# Altium schematic sheet Sheet1.SchDoc
size A4
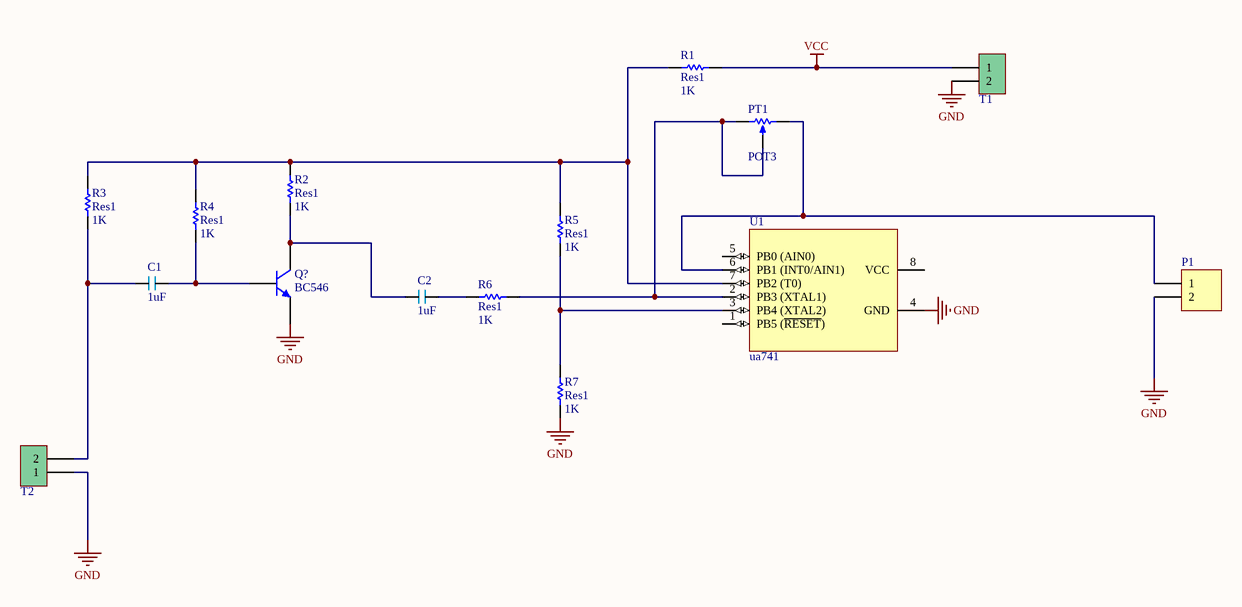
[diagram p0: Sheet1.SchDoc]

## Parts
C1  1uF  [RAD_ADA]
C2  1uF  [RAD_ADA]
P1  Header 2  [My_1X02]  (value not drawn)
PT1  POT3  [POT3]
Q?  BC546  [SOT54]
R1  Res1  value 1K  [AXIAL-0.3]
R2  Res1  value 1K  [AXIAL-0.3]
R3  Res1  value 1K  [AXIAL-0.3]
R4  Res1  value 1K  [AXIAL-0.3]
R5  Res1  value 1K  [AXIAL-0.3]
R6  Res1  value 1K  [AXIAL-0.3]
R7  Res1  value 1K  [AXIAL-0.3]
T1  Phoenix terminal  [phoenix terminal 2]  (value not drawn)
T2  Phoenix terminal  [phoenix terminal 2]  (value not drawn)
U1  ua741  [My_8P3]

## Nets
GND: P1.2 Q?.1(E) R7.1 T1.2 T2.1 U1.4(GND)
VCC: R1.1 T1.1
NetC1_1: C1.1 R3.1 T2.2
NetC1_2: C1.2 Q?.2(B) R4.1
NetC2_1: C2.1 Q?.3(C) R2.1
NetC2_2: C2.2 R6.2
NetP1_1: P1.1 PT1.2(BOT) U1.6(PB1_(INT0/AIN1))
NetPT1_1: PT1.1(TOP) PT1.3(TAP) R6.1 U1.2(PB3_(XTAL1))
NetR1_2: R1.2 R2.2 R3.2 R4.2 R5.2 U1.7(PB2_(T0))
NetR5_1: R5.1 R7.2 U1.3(PB4_(XTAL2))

Not connected (* = marked no-connect by the designer): U1 1(PB5_(~{RESET})) 5(PB0_(AIN0)) 8(VCC)

## Library data of the parts
C1 C2 = CAP
P1 = Header 2: Header, 2-Pin; LatestRevisionDate: 17-Jul-2002; LatestRevisionNote: Re-released for DXP Platform.; Publisher: Altium Limited
PT1 = POT3: Variable Potentiometer top adjust; Designer: Seyed Mohsen Ghasemian; WEB: www.picpars.com
Q? = BC546: NPN General-purpose Transistor; Published: 17-Sep-2003; LatestRevisionDate: 12-Dec-2006; LatestRevisionNote: Footprint pad sequence fixed.; DatasheetVersion: 15-Apr-1999; PackageVersion: Feb-1997; PackageReference: SOT54; Publisher: Altium Limited; PackageDescription: Plastic Single-Ended Leaded (through hole) package; 3 Leads (TO-92); Code_JEITA: SC-43; Code_JEDEC: TO-92; ComponentLink1Description: Manufacturer Link; ComponentLink1URL: http://www.semiconductors.philips.com/; ComponentLink2Description: Datasheet; ComponentLink2URL: http://www.semiconductors.philips.com/acrobat/datasheets/BC546_547_3.pdf
R1-R7 = Res1: Resistor; Published: 8-Jun-2000; LatestRevisionDate: 17-Jul-2002; LatestRevisionNote: Re-released for DXP Platform.; PackageReference: AXIAL-0.3; Publisher: Altium Limited; PackageDescription: Axial Device, Thru-Hole; 2 Leads; 0.3 in Pin Spacing
T1 T2 = Phoenix terminal 2: Terminal 2 Pin; Designer: Seyed Mohsen Ghasemain; E-mail: picpars@gmail.com; ComponentLinkURL: www.picpars.com
U1 = ATtiny11-6PI: AVR 1K Byte of Flash Memory; Published: 17-Sep-2003; LatestRevisionDate: 04-Mar-2005; LatestRevisionNote: Stylized 3D Model Added.; DatasheetVersion: 1006C-09/01; PackageVersion: revB, Sep-2001; PackageReference: 8P3; Publisher: Altium Limited; PackageDescription: DIP; 8 Leads; Row Spacing 7.62 mm; Pitch 2.54 mm; ComponentLink1Description: Manufacturer Link; ComponentLink1URL: http://www.atmel.com; ComponentLink2Description: Datasheet; ComponentLink2URL: http://www.atmel.com/dyn/resources/prod_documents/doc1006.pdf